# Altium schematic sheet zehnder-comfoair-esp32.SchDoc
size A; SheetNumber: 1; SheetTotal: 1
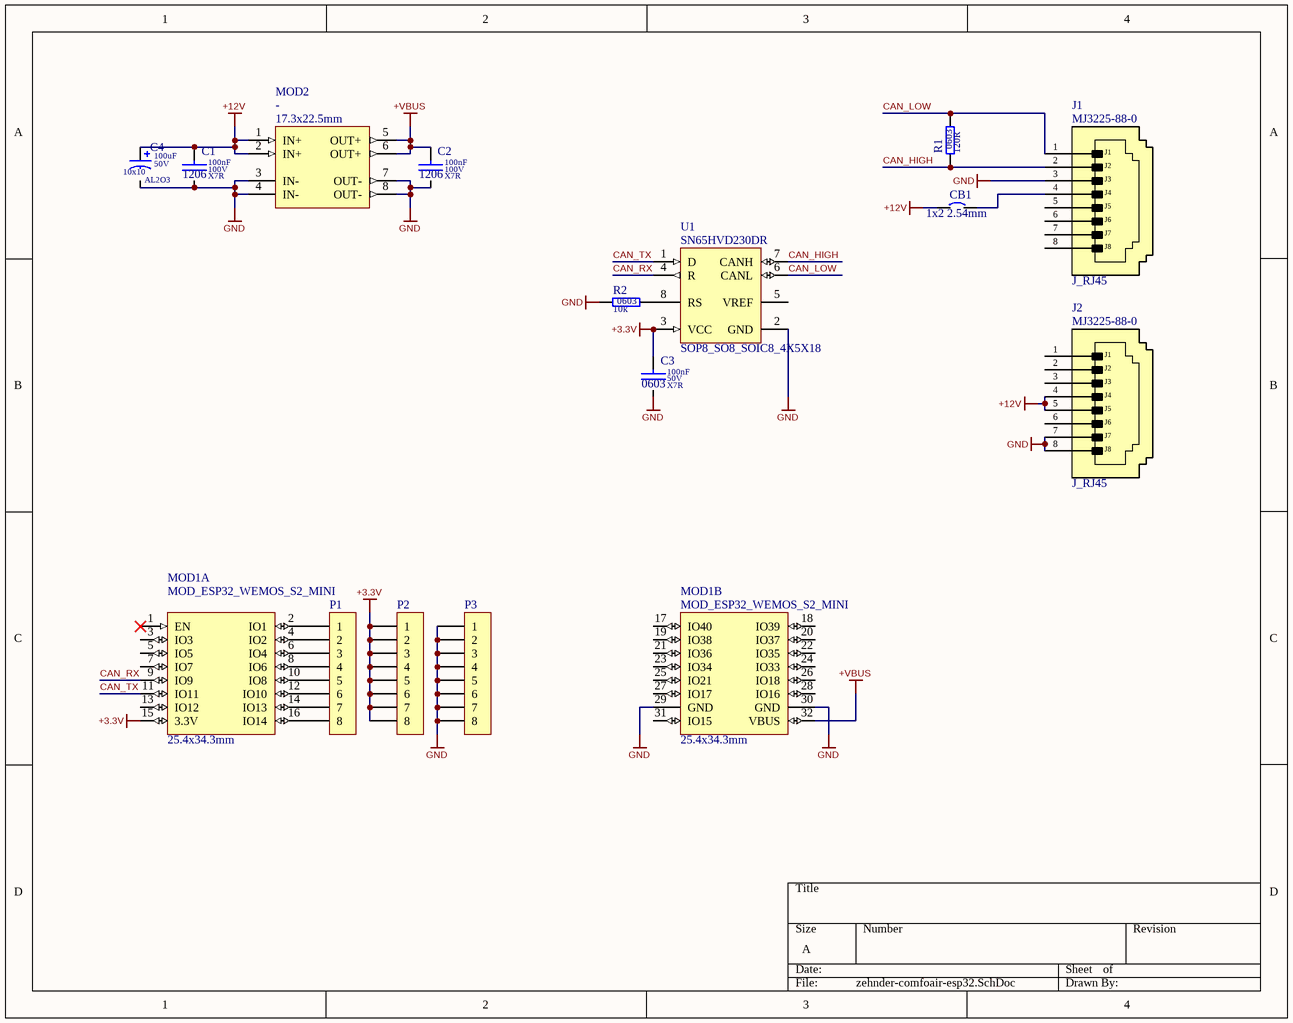
[diagram p0: zehnder-comfoair-esp32.SchDoc]

## Parts
C1  value 100nF  Dielectric: X7R  Voltage: 100V  SCH_Footprint: 1206  [C_1206_3216]  (hidden comment: Ceramic X7R)
C2  value 100nF  Dielectric: X7R  Voltage: 100V  SCH_Footprint: 1206  [C_1206_3216]  (hidden comment: Ceramic X7R)
C3  value 100nF  Dielectric: X7R  Voltage: 50V  SCH_Footprint: 0603  [C_0603_1608]  (hidden comment: Ceramic X7R)
C4  value 100uF  Dielectric: AL2O3  SCH_Footprint: 10x10  Voltage: 50V  [CE_D_10x10MM]  (hidden comment: Electrolytic Capacitor)
CB1  SCH_Footprint: 1x2 2.54mm  [P_HEADER_1x2_2.54]  (hidden comment: Goldpin)
J1  value MJ3225-88-0  [J_RJ45_MJ3225-88-0]  (hidden comment: Modular Connector, Modular Jack, 1 x 1 (Port), 8P8C, Cat3)
J2  value MJ3225-88-0  [J_RJ45_MJ3225-88-0]  (hidden comment: Modular Connector, Modular Jack, 1 x 1 (Port), 8P8C, Cat3)
MOD1  value MOD_ESP32_WEMOS_S2_MINI  SCH_Footprint: 25.4x34.3mm  [MOD_ESP32_WEMOS_S2_MINI]  (hidden comment: ESP32-S2FN4R2 mini wifi board)  (parts A,B of 2)
MOD2  SCH_Footprint: 17.3x22.5mm  [MOD_BUCK_MP1584]  (hidden comment: Low cost, Aliexpress-ready DC-DC buck converter using MP1584)
P1  Goldpin  [P_HEADER_1x8_2.54]  (value not drawn)
P2  Goldpin  [P_HEADER_1x8_2.54]  (value not drawn)
P3  Goldpin  [P_HEADER_1x8_2.54]  (value not drawn)
R1  value 120R  SCH_Footprint: 0603  [R_0603_1608]  (hidden comment: Resistor)
R2  value 10k  SCH_Footprint: 0603  [R_0603_1608]  (hidden comment: Resistor)
U1  value SN65HVD230DR  [SOP8_SO8_SOIC8_4X5X18]  (hidden comment: SN65HVD23x 3.3-V CAN Bus Transceivers)

## Nets
+3.3V: C3.1 MOD1.15(3.3V) P2.1 P2.2 P2.3 P2.4 P2.5 P2.6 P2.7 P2.8 U1.3(VCC)
+12V: C1.1 C4.1 CB1.1 J2.4 J2.5 MOD2.1(IN+) MOD2.2(IN+)
+VBUS: C2.1 MOD1.32(VBUS) MOD2.5(OUT+) MOD2.6(OUT+)
GND: C1.2 C2.2 C3.2 C4.2 J1.3 J2.7 J2.8 MOD1.29(GND) MOD1.30(GND) MOD2.3(IN-) MOD2.4(IN-) MOD2.7(OUT-) MOD2.8(OUT-) P3.1 P3.2 P3.3 P3.4 P3.5 P3.6 P3.7 P3.8 R2.1 U1.2(GND)
CAN_HIGH: J1.2 R1.1 U1.7(CANH)
CAN_LOW: J1.1 R1.2 U1.6(CANL)
CAN_RX: MOD1.9(IO9) U1.4(R)
CAN_TX: MOD1.11(IO11) U1.1(D)
NetCB1_2: CB1.2 J1.4
NetMOD1_2: MOD1.2(IO1) P1.1
NetMOD1_4: MOD1.4(IO2) P1.2
NetMOD1_6: MOD1.6(IO4) P1.3
NetMOD1_8: MOD1.8(IO6) P1.4
NetMOD1_10: MOD1.10(IO8) P1.5
NetMOD1_12: MOD1.12(IO10) P1.6
NetMOD1_14: MOD1.14(IO13) P1.7
NetMOD1_16: MOD1.16(IO14) P1.8
NetR2_2: R2.2 U1.8(RS)

Not connected (* = marked no-connect by the designer): J1 5 6 7 8; J2 1 2 3 6; MOD1 1(EN)* 3(IO3) 5(IO5) 7(IO7) 13(IO12) 17(IO40) 18(IO39) 19(IO38) 20(IO37) 21(IO36) 22(IO35) 23(IO34) 24(IO33) 25(IO21) 26(IO18) 27(IO17) 28(IO16) 31(IO15); U1 5(VREF)

## Notes on the sheet
- (in symbol J_RJ45_MJ3225-88-0) J2; J3; J4; J5; J6; J7; J8; J1

## Library data of the parts
C1 C2 = C_100nF_100V_X7R_1206_10: Capacitor; Manufacturer: Samsung; Manufacturer Part Number: CL31B104KCFNNNE; Tolerance (%): 10; Part Number: C_100nF_100V_X7R_1206_10; HelpURL: https://datasheet.octopart.com/CL31B104KCFNNNE-Samsung-datasheet-8331463.pdf; Supplier 1: TME; Supplier 2: RS Components; Supplier 3: Farnell; Supplier 4: Mouser; Supplier 5: Digi-Key; Supplier 6: LCSC
C3 = C_100nF_50V_X7R_0603_5: Capacitor; Manufacturer: Samsung; Manufacturer Part Number: CL10B104JB8NNNC; Tolerance (%): 5; Part Number: C_100nF_50V_X7R_0603_5; HelpURL: http://www.tme.eu/pl/Document/4a42202b32dab16128fe107dd69598cc/samsung-chip-cap.pdf; Supplier 1: TME; Supplier Part Number 1: CL10B104JB8NNNC; Supplier 2: RS Components; Supplier Part Number 2: 7665455; Supplier 3: Farnell; Supplier 4: Mouser; Supplier 5: Digi-Key; Supplier Part Number 5: 1276-1033-1-ND; Supplier 6: LCSC; Supplier Part Number 6: C24452
C4 = CE_100uF_50V_AL2O3_10x10_20: Polarized Capacitor; Manufacturer: Nichicon; Manufacturer Part Number: UUX1H101MNL1GS; Tolerance (%): 20; Part Number: CE_100uF_50V_AL2O3_10x10_20; HelpURL: https://datasheet.octopart.com/UUX1H101MNL1GS-Nichicon-datasheet-62047998.pdf; Supplier 1: TME; Supplier Part Number 1: UUX1H101MNL1GS; Supplier 2: RS Components; Supplier Part Number 2: 739-3107; Supplier 3: Farnell; Supplier Part Number 3: 2841943; Supplier 4: Mouser; Supplier Part Number 4: 647-UUX1H101MNL1GS; Supplier 5: Digi-Key; Supplier Part Number 5: 493-6269-1-ND; Supplier 6: LCSC
CB1 = CB_GOLDPIN: Circuit Breaker; Part Number: CB_GOLDPIN; Supplier 1: TME; Supplier 2: RS Components; Supplier 3: Farnell; Supplier 4: Mouser; Supplier 5: Digi-Key; Supplier 6: LCSC
J1 J2 = J_RJ45_MJ3225-88-0: Manufacturer: Global Connector Technology; SCH_Footprint: J_RJ45; Part Number: J_RJ45_MJ3225-88-0; HelpURL: https://www.farnell.com/cad/3781788.pdf; Manufacturer Part Number: MJ3225-88-0; Supplier 1: TME; Supplier 2: RS Components; Supplier 3: Farnell; Supplier Part Number 3: 4071641; Supplier 4: Mouser; Supplier 5: Digi-Key; Supplier 6: LCSC; Supplier 7: Newark; Supplier Part Number 7: 61AK4308
MOD1 = MOD_ESP32_WEMOS_S2_MINI: Manufacturer: Wemos; Part Number: MOD_ESP32_WEMOS_S2_MINI; HelpURL: https://www.wemos.cc/en/latest/s2/s2_mini.html; Manufacturer Part Number: MOD_ESP32_WEMOS_S2_MINI; Supplier 1: TME; Supplier 2: RS Components; Supplier 3: Farnell; Supplier 4: Mouser; Supplier 5: Digi-Key; Supplier 6: LCSC; Supplier 7: Aliexpress; Supplier Part Number 7: https://pl.aliexpress.com/item/1005003145192016.html
MOD2 = MOD_BUCK_MP1584: Value: -; Part Number: MOD_BUCK_MP1584; HelpURL: https://pl.aliexpress.com/item/32341006065.html; Manufacturer: -; Manufacturer Part Number: -; Supplier 1: TME; Supplier 2: RS Components; Supplier 3: Farnell; Supplier 4: Mouser; Supplier 5: Digi-Key; Supplier 6: LCSC; Supplier 7: -; Supplier Part Number 7: -
P1-P3 = P_HEADER_1x8_2.54: Pin Header; Manufacturer: Connfly; Manufacturer Part Number: DS1021-1*8SF1-1; Part Number: P_HEADER_1x8_2.54; HelpURL: http://www.tme.eu/en/Document/cc301e58a5da78cb543a94b5a5b7f06a/DS1021.pdf; Supplier 1: TME; Supplier Part Number 1: ZL201-08G; Supplier 2: RS Components; Supplier 3: Farnell; Supplier 4: Mouser; Supplier 5: Digi-Key; Supplier 6: LCSC
R1 = R_120R_0603_1: Manufacturer: Panasonic; Manufacturer Part Number: ERJ3EKF1200V; Voltage: 75V; Power: 100mW; Tolerance: 1%; Part Number: R_120R_0603_1; HelpURL: http://www.farnell.com/datasheets/1911175.pdf; Supplier 1: TME; Supplier 2: RS Components; Supplier Part Number 2: 1051578; Supplier 3: Farnell; Supplier Part Number 3: 2397612; Supplier 4: Mouser; Supplier Part Number 4: 667-ERJ-3EKF1200V; Supplier 5: Digi-Key; Supplier Part Number 5: P120HCT-ND; Supplier 6: LCSC
R2 = R_10k_0603_1: Manufacturer: Vishay; Manufacturer Part Number: CRCW060310K0FKTABC; Voltage: 75V; Power: 100mW; Tolerance: 1%; Part Number: R_10k_0603_1; HelpURL: http://www.tme.eu/pl/Document/622e28308c06d160637f2b14751ba16b/Data%20Sheet%20CRCW_BCe3.pdf; Supplier 1: TME; Supplier Part Number 1: CRCW060310K0FKTABC; Supplier 2: RS Components; Supplier 3: Farnell; Supplier 4: Mouser; Supplier Part Number 4: 667-ERJ-3EKF1002V; Supplier 5: Digi-Key; Supplier Part Number 5: P10KGCT-ND; Supplier 6: LCSC
U1 = U_SN65HVD230DR: Manufacturer: Texas Instruments; SCH_Footprint: SOP8_SO8_SOIC8_4X5X18; Part Number: U_SN65HVD230DR; HelpURL: http://www.ti.com/lit/ds/symlink/sn65hvd230.pdf; Manufacturer Part Number: SN65HVD230DR; Supplier 1: TME; Supplier Part Number 1: SN65HVD230DR; Supplier 2: RS Components; Supplier Part Number 2: 2184566; Supplier 3: Farnell; Supplier Part Number 3: 3124671; Supplier 4: Mouser; Supplier Part Number 4: 595-SN65HVD230DR; Supplier 5: Digi-Key; Supplier Part Number 5: 296-11654-1-ND; Supplier 6: LCSC; Supplier 7: Arrow Electronics; Supplier Part Number 7: SN65HVD230DR